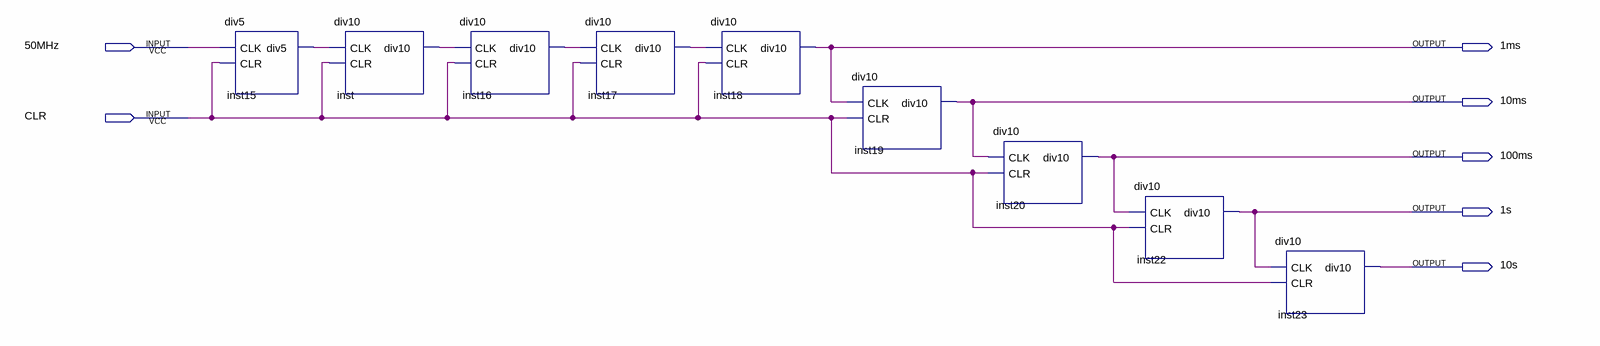
[diagram p0: schematic sheet]
// Quartus schematic divider.bdf as structural Verilog: 9 symbols, 7 pins
module divider (
  input  \50MHz ,
  input  CLR,
  output \1ms ,
  output \10ms ,
  output \100ms ,
  output \1s ,
  output \10s 
);

  wire inst15_div5, inst16_div10, inst17_div10, inst_div10;

  div5 inst15 (.CLK(\50MHz ), .CLR(CLR), .div5(inst15_div5));
  div10 inst (.CLK(inst15_div5), .CLR(CLR), .div10(inst_div10));
  div10 inst16 (.CLK(inst_div10), .CLR(CLR), .div10(inst16_div10));
  div10 inst17 (.CLK(inst16_div10), .CLR(CLR), .div10(inst17_div10));
  div10 inst18 (.CLK(inst17_div10), .CLR(CLR), .div10(\1ms ));
  div10 inst19 (.CLK(\1ms ), .CLR(CLR), .div10(\10ms ));
  div10 inst20 (.CLK(\10ms ), .CLR(CLR), .div10(\100ms ));
  div10 inst22 (.CLK(\100ms ), .CLR(CLR), .div10(\1s ));
  div10 inst23 (.CLK(\1s ), .CLR(CLR), .div10(\10s ));
endmodule
